# Altium project Arduino_Converter3.3V.PrjPcb
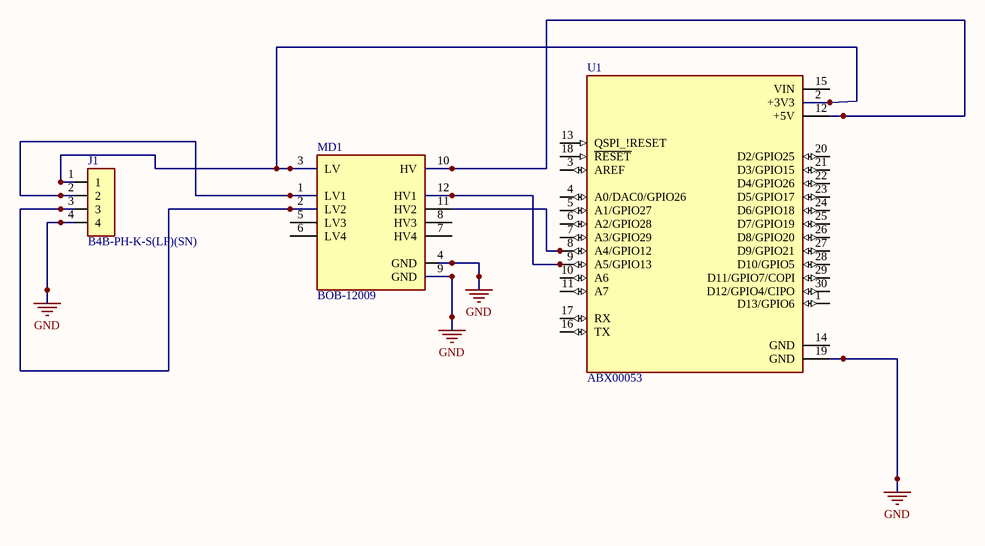
[diagram p0: Arduino_Converter3.3V.SchDoc]
1 sheet, 3 parts. Net scope: global (net labels, ports and power ports of the same name join across sheets).
Board file: PCB2.PcbDoc

## Sheet Arduino_Converter3.3V.SchDoc
size A; SheetNumber: 1; SheetTotal: 1

### Parts
J1  B4B-PH-K-S(LF)(SN)  [JST_B4B-PH-K-S(LF)(SN)]
MD1  BOB-12009  [FP-BOB-12009-MFG]
U1  ABX00053  [MODULE_ABX00053]

### Nets
GND: J1.4 MD1.4(GND) MD1.9(GND) U1.19(GND)
NetJ1_1: J1.1 MD1.3(LV) U1.2(+3V3)
NetJ1_2: J1.2 MD1.1(LV1)
NetJ1_3: J1.3 MD1.2(LV2)
NetMD1_10: MD1.10(HV) U1.12(+5V)
NetMD1_11: MD1.11(HV2) U1.8(A4/GPIO12)
NetMD1_12: MD1.12(HV1) U1.9(A5/GPIO13)

Not connected (* = marked no-connect by the designer): MD1 5(LV3) 6(LV4) 7(HV4) 8(HV3); U1 1(D13/GPIO6) 3(AREF) 4(A0/DAC0/GPIO26) 5(A1/GPIO27) 6(A2/GPIO28) 7(A3/GPIO29) 10(A6) 11(A7) 13(QSPI_!RESET) 14(GND) 15(VIN) 16(TX) 17(RX) 18(~{RESET}) 20(D2/GPIO25) 21(D3/GPIO15) 22(D4/GPIO26) 23(D5/GPIO17) 24(D6/GPIO18) 25(D7/GPIO19) 26(D8/GPIO20) 27(D9/GPIO21) 28(D10/GPIO5) 29(D11/GPIO7/COPI) 30(D12/GPIO4/CIPO)

### Library data of the parts
J1 = B4B-PH-K-S(LF)(SN): PH Series 4 Position 2 mm Pitch Through Hole Crimp Top Entry Shrouded Header; Package: None; Availability: Unavailable; Value: *; MP: B4B-PH-K-S(LF)(SN); Price: None
MD1 = CMP-157458-000001-1: LOGIC LEVEL CONVERTER - BI-DIREC; Logic Function: Translator
U1 = ABX00053: ARDUINO NANO RP2040 CONNECT WITH; MF: Arduino; SnapEDA_Link: https://www.snapeda.com/parts/ABX00053/Arduino/view-part/6098734/?ref=snap; Package: None; MP: ABX00053; Price: None; Availability: In Stock; Check_prices: https://www.snapeda.com/parts/ABX00053/Arduino/view-part/6098734/?ref=eda; Value: *